# EasyEDA Pro project ProPrj_USB_hub_2026-05-25.epro

# Schematic Schematic1
Board Name: Board1; Create Date: 2026-04-25; Page Name: P1; Project Name: USB_hub; Schematic Name: Schematic1; Update Date: 2026-04-26; Company: EasyEDA.com; Page Size: A4; Version: V1.0
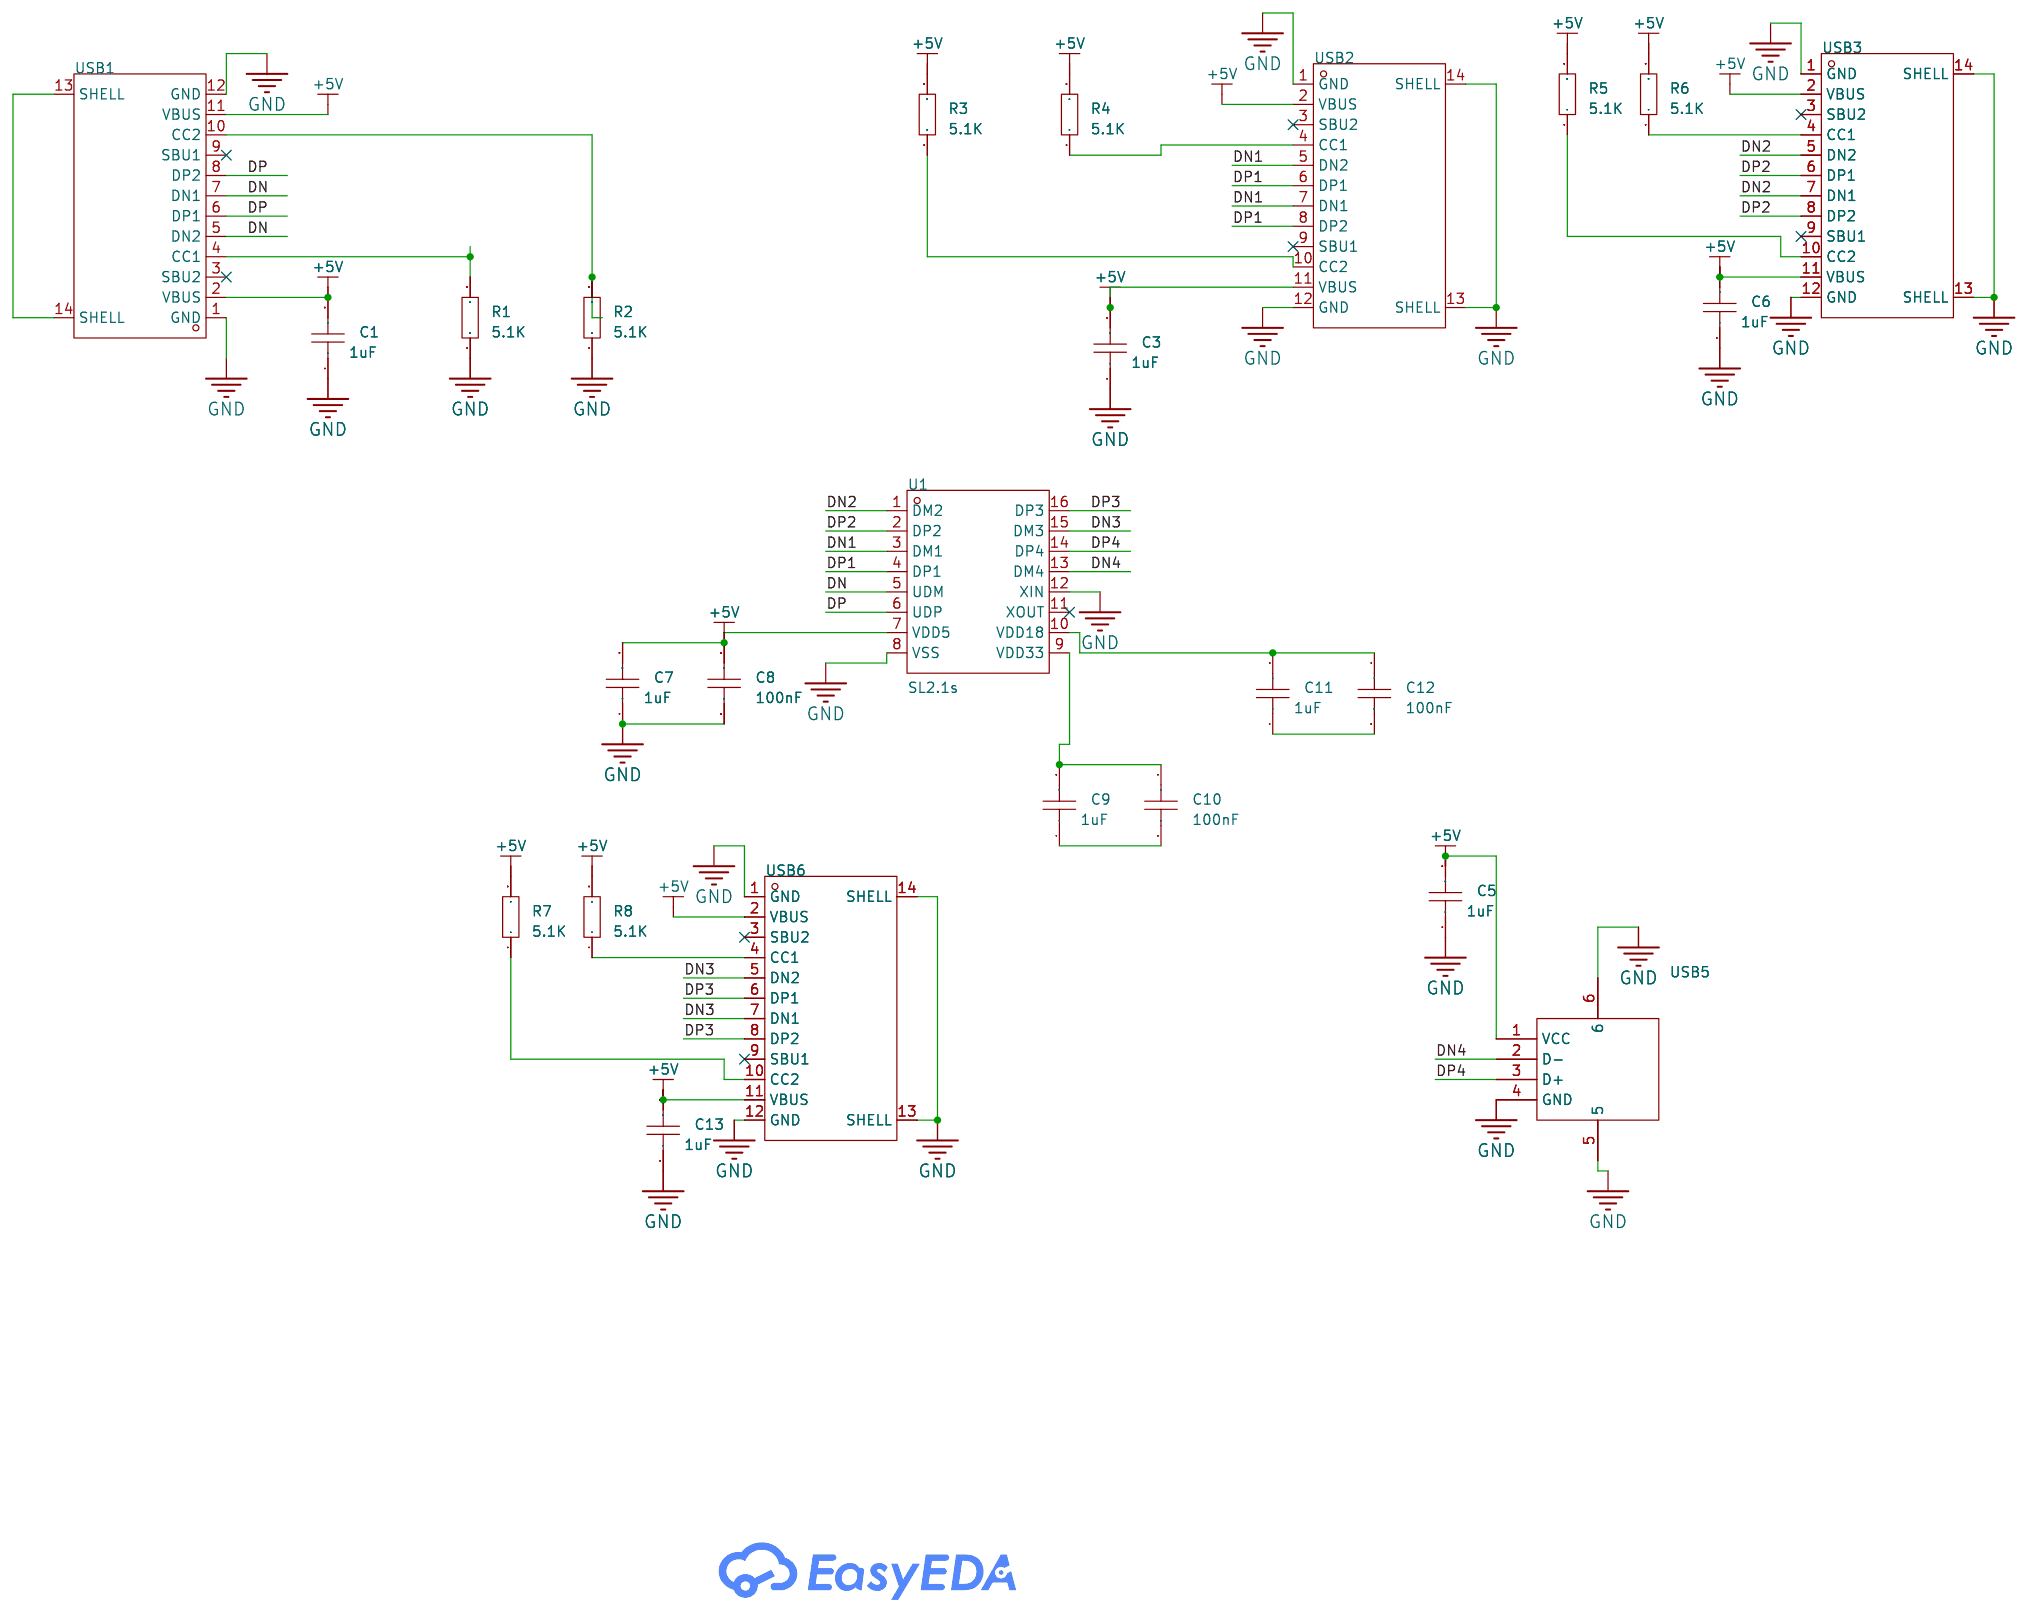
[diagram p0: schematic sheet]

## Parts
C1  1uF  [C0603]
C3  1uF  [C0603]
C5  1uF  [C0603]
C6  1uF  [C0603]
C7  1uF  [C0603]
C8  100nF  [C0603]
C9  1uF  [C0603]
C10  100nF  [C0603]
C11  1uF  [C0603]
C12  100nF  [C0603]
C13  1uF  [C0603]
R1  5.1K  [R0603]
R2  5.1K  [R0603]
R3  5.1K  [R0603]
R4  5.1K  [R0603]
R5  5.1K  [R0603]
R6  5.1K  [R0603]
R7  5.1K  [R0603]
R8  5.1K  [R0603]
U1  SL2.1s  [SSOP-16_L4.6-W2.6-P0.53-LS4.0-BL]
USB1  TYPE-C 16PIN 2MD(073)  [USB-C-SMD_TYPE-C-6PIN-2MD-073]
USB2  TYPE-C 16PIN 2MD(073)  [USB-C-SMD_TYPE-C-6PIN-2MD-073]
USB3  TYPE-C 16PIN 2MD(073)  [USB-C-SMD_TYPE-C-6PIN-2MD-073]
USB5  10.0 QHHTZB6.3  [USB-A-TH_10.0QHHTZB6.3]
USB6  TYPE-C 16PIN 2MD(073)  [USB-C-SMD_TYPE-C-6PIN-2MD-073]

## Library data of the parts
C1 C3 C5-C13 = CAP_0603: Supplier Footprint: 0603
R1-R8 = Res_0603: Supplier Footprint: 0603
U1 = SL2.1s: type:Hub USB Protocol:USB 2.0 Data Rate:- Voltage - Supply:4V~5.25V Voltage - Supply:4V~5.25V Operating Temperature:0℃~+70℃ Operating Temperature:0℃~+70℃ Memory Interface:- Current - Supply:120mA Quiescent Supply Current:2.5mA Number of Channels:4; LCSC Part Name: USB2.0 HUB控制器集成电路; Supplier Part: C2684433; Manufacturer: CoreChips(和芯润德); Supplier Footprint: SSOP-16; JLCPCB Part Class: Extended Part; Datasheet: https://item.szlcsc.com/datasheet/SL2.1s/2782346.html; Supplier: LCSC; type: Hub; USB Protocol: USB 2.0; Voltage - Supply: 4V~5.25V; Operating Temperature: 0℃~+70℃; Current - Supply: 120mA; Quiescent Supply Current: 2.5mA; Number of Channels: 4
USB1-USB3 USB6 = TYPE-C 16PIN 2MD(073): Connector Type:Type-C Protocol Standard:- Gender:Female Mounting Type:Surface Mount, Right Angle Number of Contacts:16P Number of Ports:1 Current Rating-Power:3A Voltage Rating:5V Connect-Disconnect Life:10,000 Cycles Supplementary Features:- Center Heigh; LCSC Part Name: Type-C 母 卧贴; Supplier Part: C2765186; Manufacturer: SHOU HAN(首韩); Supplier Footprint: SMD; JLCPCB Part Class: Extended Part; Datasheet: https://item.szlcsc.com/datasheet/TYPE-C%252016PIN%25202MD(073)/2901843.html; Supplier: LCSC; Connector Type: Type-C; Gender: Female; Mounting Type: Surface Mount, Right Angle; Number of Contacts: 16P; Number of Ports: 1; Current Rating-Power: 3A; Voltage Rating: 5V; Connect-Disconnect Life: 10,000 Cycles; Detection color: Black; Operating Temperature: -25℃~+85℃
USB5 = 10.0 QHHTZB6.3: Connector Type:Type-A Protocol Standard:USB 2.0 Gender:Female Mounting Type:Surface Mount, Right Angle Number of Contacts:4P Number of Ports:1 Current Rating-Power:1.5A Voltage Rating:30V Connect-Disconnect Life:5,000 times Supplementary Features:- Center; LCSC Part Name: 壳长10.0mm; Supplier Part: C668591; Manufacturer: SHOU HAN(首韩); Supplier Footprint: SMD; JLCPCB Part Class: Extended Part; Datasheet: https://item.szlcsc.com/datasheet/10.0%2520QHHTZB6.3/698534.html; Supplier: LCSC; Connector Type: Type-A; Protocol Standard: USB 2.0; Gender: Female; Mounting Type: Surface Mount, Right Angle; Number of Contacts: 4P; Number of Ports: 1; Current Rating-Power: 1.5A; Voltage Rating: 30V; Connect-Disconnect Life: 5,000 times; Length: 10mm; Detection color: Black; Operating Temperature: -25℃~+85℃

## Nets
+5V: C1.2 C3.2 C5.2 C6.2 C7.2 C8.1 C13.2 R3.2 R4.2 R5.2 R6.2 R7.2 R8.2 U1.7(VDD5) USB1.2(VBUS) USB1.11(VBUS) USB2.2(VBUS) USB2.11(VBUS) USB3.2(VBUS) USB3.11(VBUS) USB5.1(VCC) USB6.2(VBUS) USB6.11(VBUS)
GND: C1.1 C3.1 C5.1 C6.1 C7.1 C8.2 C13.1 R1.1 R2.1 U1.8(VSS) U1.12(XIN) USB1.1(GND) USB1.12(GND) USB2.1(GND) USB2.12(GND) USB2.13(SHELL) USB2.14(SHELL) USB3.1(GND) USB3.12(GND) USB3.13(SHELL) USB3.14(SHELL) USB5.4(GND) USB5.5 USB5.6 USB6.1(GND) USB6.12(GND) USB6.13(SHELL) USB6.14(SHELL)
DN: U1.5(UDM) USB1.5(DN2) USB1.7(DN1)
DN1: U1.3(DM1) USB2.5(DN2) USB2.7(DN1)
DN2: U1.1(DM2) USB3.5(DN2) USB3.7(DN1)
DN3: U1.15(DM3) USB6.5(DN2) USB6.7(DN1)
DN4: U1.13(DM4) USB5.2(D-)
DP: U1.6(UDP) USB1.6(DP1) USB1.8(DP2)
DP1: U1.4(DP1) USB2.6(DP1) USB2.8(DP2)
DP2: U1.2(DP2) USB3.6(DP1) USB3.8(DP2)
DP3: U1.16(DP3) USB6.6(DP1) USB6.8(DP2)
DP4: U1.14(DP4) USB5.3(D+)
$1N1031: USB1.13(SHELL) USB1.14(SHELL)
$1N1114: R1.2 USB1.4(CC1)
$1N1121: R2.2 USB1.10(CC2)
$1N1950: R4.1 USB2.4(CC1)
$1N2056: R6.1 USB3.4(CC1)
$1N2060: R5.1 USB3.10(CC2)
$1N2827: R3.1 USB2.10(CC2)
$1N3280: C9.2 C10.1 U1.9(VDD33)
$1N3283: C9.1 C10.2
$1N3346: C11.2 C12.1 U1.10(VDD18)
$1N3348: C11.1 C12.2
$1N4259: R8.1 USB6.4(CC1)
$1N4260: R7.1 USB6.10(CC2)

Not connected (* = marked no-connect by the designer): U1 11(XOUT)*; USB1 3(SBU2)* 9(SBU1)*; USB2 3(SBU2)* 9(SBU1)*; USB3 3(SBU2)* 9(SBU1)*; USB6 3(SBU2)* 9(SBU1)*

# Board PCB1
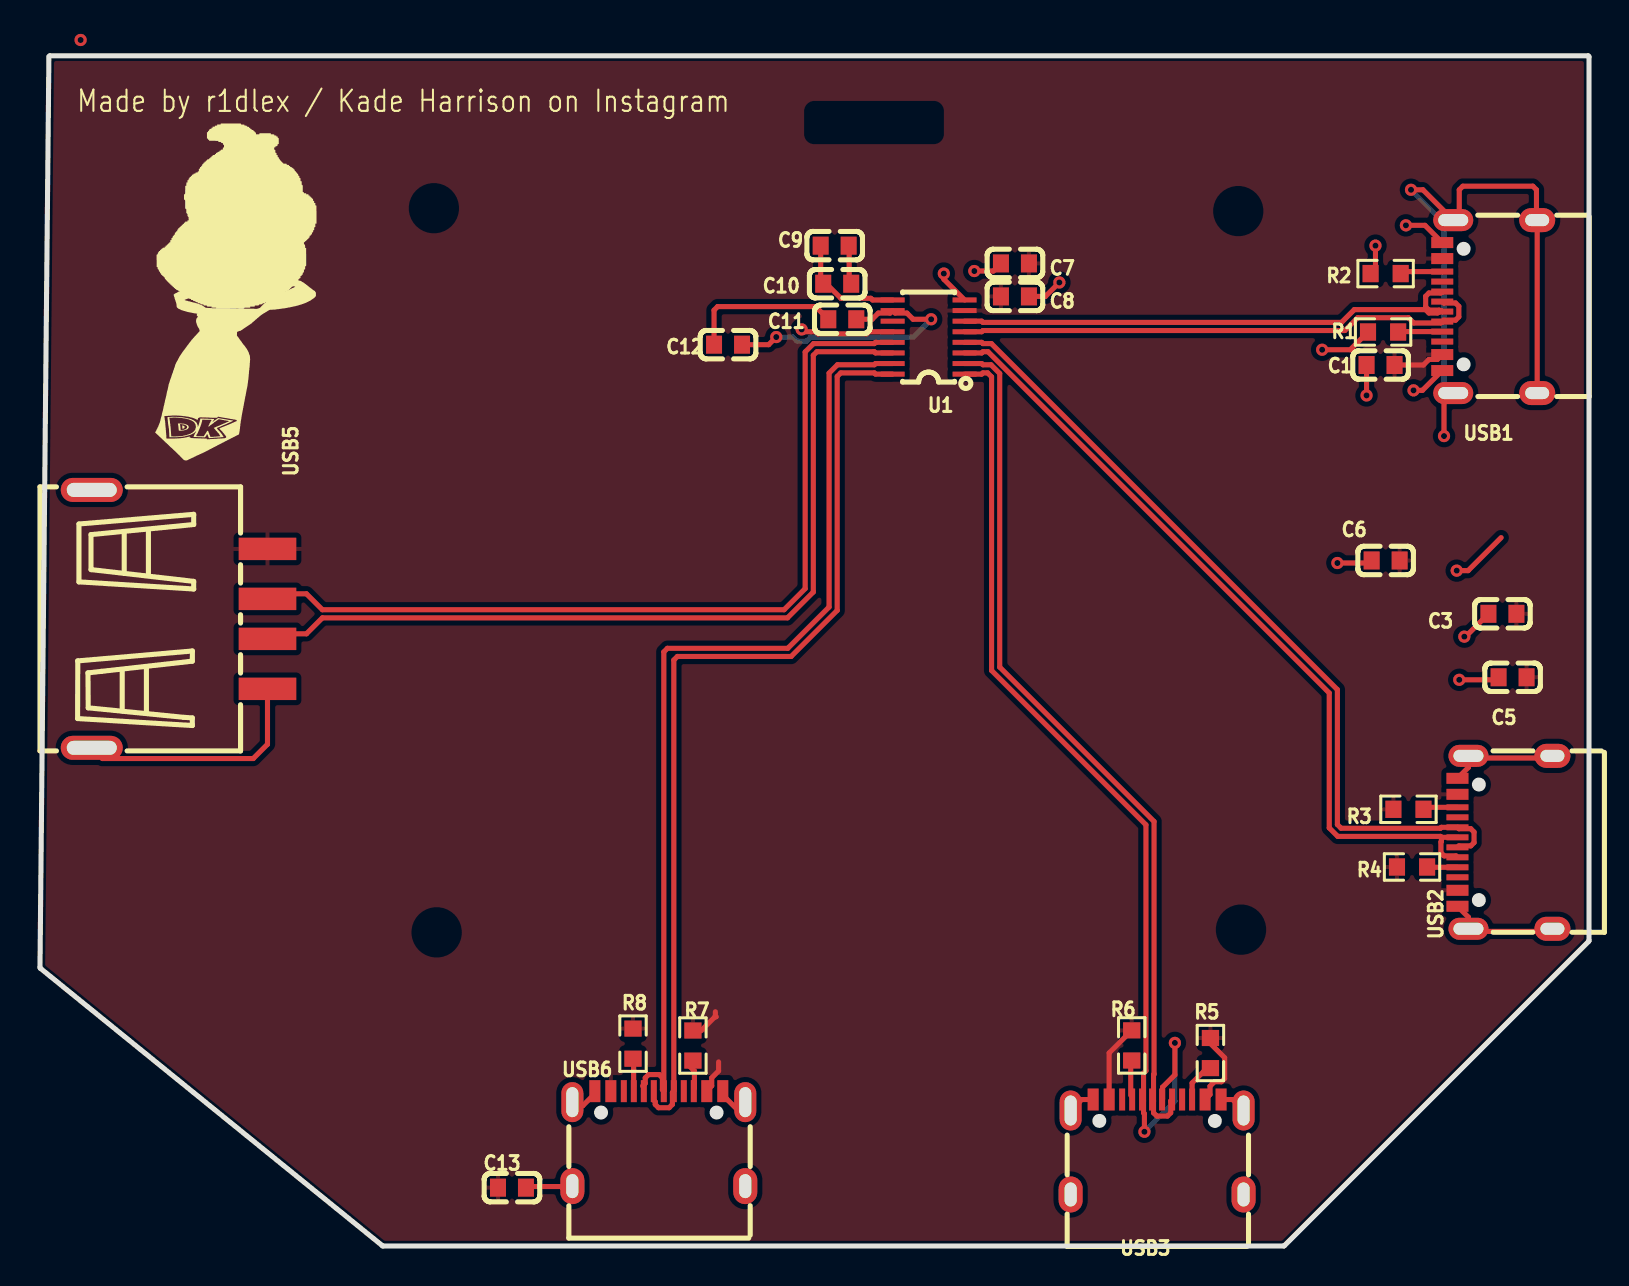
[diagram p1: board, top side]
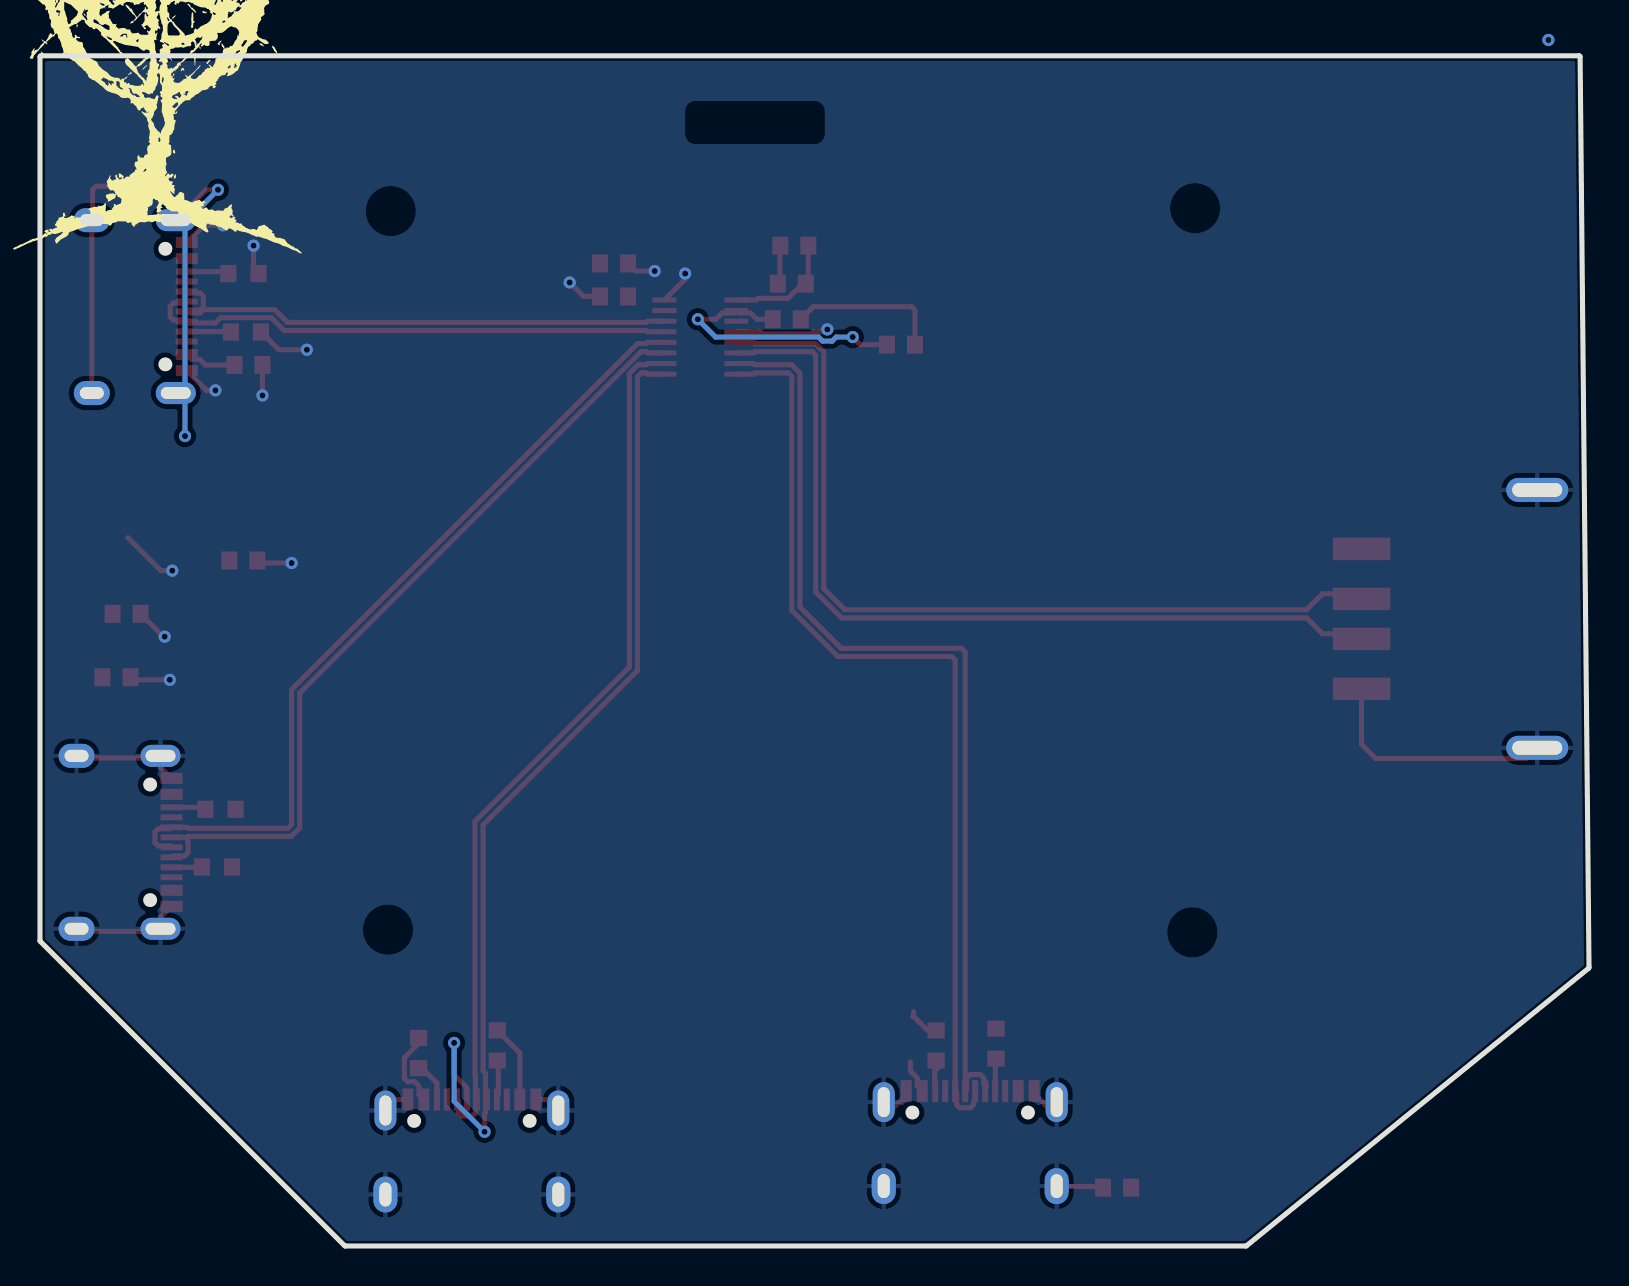
[diagram p2: board, bottom side, seen from below]

Outline 77.48 x 59.53 mm; copper layers: Top Layer, Bottom Layer. Coordinates in mm from the lower left corner of the outline.
Outline path: 0.02,13.89 arc(0.01,13.91) 0,13.93 0.45,59.48 arc(0.46,59.52) 0.5,59.53 77.43,59.53 arc(77.47,59.52) 77.48,59.48 77.48,15.27 arc(77.48,15.26) 77.47,15.24 62.24,0.01 arc(62.23,0) 62.21,0 17.16,0 arc(17.15,0) 17.13,0.01 0.02,13.89
Stack: Top Layer 0.035mm / Dielectric1 1.51mm FR4 er 4.5 / Bottom Layer 0.035mm

## Design rules (mm)
net DN2: DP3
net DP2: DP3
net DN1: DP2
net DP1: DP2
net DN: DP1
net DP: DP1
net DN4: DP5
net DP4: DP5
net DN3: DP4
net DP3: DP4
template: Custom Config
spacing copperThickness1oz (default): track to track 0.102, other pairs 0.152 to 0.3
spacing copperThickness2oz: track to track 0.203, other pairs 0.152 to 0.3
track width copperThickness1oz (default): min 0.127, default 0.254, max 2.54
track width copperThickness2oz: min 0.203, default 0.254, max 2.54
differential pair differentialPair (default): width min 0.127, default 0.254, max 2.54; gap min 0.152, default 0.152
via viaSize (default): diameter min 0.5, default 0.61, max 10; hole min 0.3, default 0.305, max 6.3

## Placement (name value [footprint] x y rotation side)
C1  1uF  [C0603]  67.06 44.07 0 top
C3  1uF  [C0603]  73.15 31.62 0 top
C5  1uF  [C0603]  73.66 28.45 0 top
C6  1uF  [C0603]  67.31 34.29 0 top
C7  1uF  [C0603]  48.77 49.15 0 top
C8  100nF  [C0603]  48.77 47.5 0 top
C9  1uF  [C0603]  39.75 50.04 180 top
C10  100nF  [C0603]  39.88 48.13 0 top
C11  1uF  [C0603]  40.13 46.35 0 top
C12  100nF  [C0603]  34.42 45.08 180 top
C13  1uF  [C0603]  23.61 2.92 180 top
R1  5.1K  [R0603]  67.18 45.72 0 top
R2  5.1K  [R0603]  67.31 48.64 0 top
R3  5.1K  [R0603]  68.45 21.84 180 top
R4  5.1K  [R0603]  68.63 18.96 180 top
R5  5.1K  [R0603]  58.55 9.65 90 top
R6  5.1K  [R0603]  54.61 10.03 90 top
R7  5.1K  [R0603]  32.66 10.03 90 top
R8  5.1K  [R0603]  29.66 10.12 90 top
U1  SL2.1s  [SSOP-16_L4.6-W2.6-P0.53-LS4.0-BL]  44.45 45.47 90 top
USB1  TYPE-C 16PIN 2MD(073)  [USB-C-SMD_TYPE-C-6PIN-2MD-073]  72.52 46.99 90 top
USB2  TYPE-C 16PIN 2MD(073)  [USB-C-SMD_TYPE-C-6PIN-2MD-073]  73.28 20.19 90 top
USB3  TYPE-C 16PIN 2MD(073)  [USB-C-SMD_TYPE-C-6PIN-2MD-073]  55.88 4.95 0 top
USB5  10.0 QHHTZB6.3  [USB-A-TH_10.0QHHTZB6.3]  6.98 31.37 270 top
USB6  TYPE-C 16PIN 2MD(073)  [USB-C-SMD_TYPE-C-6PIN-2MD-073]  30.95 5.37 0 top

## Footprints (pads in the part's own frame, mm; a bottom-side part is the same pattern mirrored in y, then rotated)
C0603
  rect 0.8x0.9 smd: 1(-0.7,0) 2(0.7,0)
R0603
  rect 0.806x0.864 smd: 1(-0.753,0) 2(0.753,0)
SSOP-16_L4.6-W2.6-P0.53-LS4.0-BL
  rect 0.25x1.2 smd: 1(-1.855,-1.8) 2(-1.325,-1.8) 3(-0.795,-1.8) 4(-0.265,-1.8) 5(0.265,-1.8) 6(0.795,-1.8) 7(1.325,-1.8) 8(1.855,-1.8) 9(1.855,1.8) 10(1.325,1.8) 11(0.795,1.8) 12(0.265,1.8) 13(-0.265,1.8) 14(-0.795,1.8) 15(-1.325,1.8) 16(-1.855,1.8)
USB-A-TH_10.0QHHTZB6.3
  rect 1.12x2.88 smd: 1(-3.5,4.395) 2(-1,4.395) 3(1,4.395) 4(3.5,4.395)
  oval 1.2x3.1 hole 0.7x2.5: 5(-6.45,-4.395) 6(6.45,-4.395)
USB-C-SMD_TYPE-C-6PIN-2MD-073
  rect 0.55x1.1 smd: 1(-3.2,2.375) 2(-2.4,2.375) 11(2.4,2.375) 12(3.2,2.375)
  rect 0.3x1.1 smd: 3(-1.75,2.375) 4(-1.25,2.375) 5(-0.75,2.375) 6(-0.25,2.375) 7(0.25,2.375) 8(0.75,2.375) 9(1.25,2.375) 10(1.75,2.375)
  oval 1.1x2 hole 0.6x1.5: 13(-4.325,1.825) 14(4.325,1.825)
  oval 1.2x1.8 hole 0.6x1.2: 13(-4.325,-2.375) 14(4.325,-2.375)

## Nets
As in the schematic.

Pads without a net: U1 11; USB1 3 9; USB2 3 9; USB3 3 9; USB6 3 9

## Via types
v1: diameter 0.61, hole 0.305, Top Layer to Bottom Layer, 20 vias

## Routing (per net, layer and track width the routed paths; a pad name or vN(x,y) marks a point on that pad's centre or on a via; arc(x,y) is an arc through that point)
+5V: length 13.4
  Top Layer w0.254: 33.95,9.21 33.95,8.76 33.6,8.41 33.6,8.01 33.4,7.81 ; USB3.2 53.48,9.66 R6.2 ; USB1.2 69.9,44.34 69.48,44.34 69.2,44.07 C1.2 ; R5.2 58.55,10.13 59.26,9.42 59.26,8.38 59.09,8.22 58.75,8.22 58.53,7.99 58.53,7.57 USB3.11 ; 33.06,10.76 33.77,11.47 33.82,11.47 33.78,11.5 33.78,11.72
GND: length 55
  Top Layer w0.254: 73.09,35.43 71.44,33.78 v1(70.87,33.78) ; 24.44,2.97 26.06,2.97 26.2,2.84 ; USB2.1 71.45,16.44 USB2.13 ; USB5.6 3.12,24.38 10.67,24.38 11.38,25.1 USB5.4 ; v1(50.99,48.2) 50.29,47.5 C8.2 ; USB3.14 59.65,7.33 USB3.12 ; USB2.12 71.45,23.94 USB2.14 ; v1(64.9,34.16) 66.48,34.16 C6.1 ; v1(66.8,50.04) 66.8,48.89 R2.1 ; 27.04,7.02 27.15,7.02 27.66,7.53 ; v1(71.25,30.48) 71.31,30.48 C3.1 ; v1(38.1,45.85) 38.22,45.73 38.81,45.73 38.92,45.63 41.35,45.63 41.45,45.73 U1.12 ; 35.15,6.55 34.31,7.4 34.15,7.4 ; v1(68.71,42.8) 69.15,42.8 USB1.1 ; C5.1 72.83,28.32 v1(70.99,28.32) ; C1.1 v1(66.36,42.55) ; USB3.1 52.11,7.33 USB3.13 ; 72.27,24.41 74.84,24.41 75.03,24.22 ; R1.1 65.54,44.83 v1(64.14,44.83) ; 75.19,15.55 75,15.74 72.38,15.74 ; v1(68.33,51.05) 69.28,51.05 USB1.12 ; v1(45.21,48.64) 45.21,48.36 U1.8 ; C7.1 47.69,48.77 v1(46.74,48.77)
(no net):
  vias: v1(2.03,60.32)
DN: length 26.7
  Top Layer w0.254: U1.5 47.1,45.73 47.17,45.79 65.27,45.79 65.91,46.43 68.45,46.43 68.72,46.17 70.07,46.17 USB1.5 70.21,46.31 70.81,46.31 70.97,46.47 70.97,47.01 70.81,47.17 70.21,47.17 USB1.7
DN1: length 40.4
  Top Layer w0.254: USB2.5 70.83,19.51 70.24,19.51 70.08,19.68 70.08,20.21 70.1,20.23 70.1,20.44 ; 70.1,20.44 70.05,20.49 64.91,20.49 64.49,20.91 64.49,27.66 47.42,44.73 47.17,44.73 47.1,44.67 U1.3 ; 70.1,20.44 USB2.7
DN2: length 50.8
  Top Layer w0.254: 55.2,7.26 55.2,8.64 55.32,8.76 55.32,21.07 47.6,28.79 47.6,43.47 47.4,43.67 47.17,43.67 47.1,43.61 U1.1 ; 55.2,7.26 55.2,6.66 55.24,6.62 v1(55.24,5.72) ; 55.2,7.26 USB3.5 ; v1(56.77,10.16) 56.77,8.56 56.15,7.95 56.15,7.35 USB3.7
  Bottom Layer w0.254: v1(55.24,5.72) 56.77,7.24 v1(56.77,10.16)
DN3: length 48.4
  Top Layer w0.254: U1.15 41.8,44.14 41.73,44.08 39.89,44.08 39.47,43.66 39.47,31.96 37.41,29.9 31.38,29.9 31.2,29.72 USB6.7 31.13,7.82 31.13,8.41 30.97,8.58 30.44,8.58 30.28,8.41 30.28,8.13 30.15,8
DN4: length 43.8
  Top Layer w0.254: 11.63,32.62 13.33,32.62 14.12,31.83 37.22,31.83 38.28,32.88 38.28,44.72 38.69,45.14 41.73,45.14 41.8,45.2 U1.13
DP: length 26.7
  Top Layer w0.254: USB1.8 70.07,47.67 69.48,47.67 69.31,47.51 69.31,46.97 69.48,46.81 70,46.81 70.05,46.76 70.12,46.76 USB1.6 69.97,46.74 69.9,46.67 69.48,46.67 69.31,46.84 65.74,46.84 65.1,46.2 47.17,46.2 47.1,46.26 U1.6
DP1: length 41.1
  Top Layer w0.254: U1.4 47.1,45.2 47.17,45.14 47.59,45.14 64.9,27.83 64.9,21.08 65.08,20.9 70.05,20.9 70.1,20.94 USB2.8 70.97,20.87 71.57,20.87 71.73,20.71 71.73,20.18 71.57,20.01 70.97,20.01 USB2.6
DP2: length 43.9
  Top Layer w0.254: 55.7,7.26 USB3.6 ; 55.7,7.26 55.7,6.66 55.86,6.5 56.4,6.5 56.56,6.66 56.56,7.26 USB3.8 ; 55.7,7.26 55.7,8.57 55.73,8.59 55.73,21.23 48.01,28.96 48.01,43.64 47.57,44.08 47.17,44.08 47.1,44.14 U1.2
DP3: length 47.2
  Top Layer w0.254: U1.16 41.8,43.61 41.73,43.67 40.06,43.67 39.88,43.49 39.88,31.79 37.57,29.49 31.88,29.49 31.7,29.31 USB6.8 31.63,7.68 31.63,7.08 31.47,6.92 30.94,6.92 30.78,7.08 30.78,7.22 30.72,7.27
DP4: length 43.8
  Top Layer w0.254: U1.14 41.8,44.67 41.73,44.73 38.86,44.73 38.68,44.55 38.68,32.71 37.39,31.42 14.12,31.42 13.33,30.62 11.63,30.62
$1N1031: length 33.9
  Top Layer w0.254: USB1.13 USB1.14 74.86,51.35 74.86,52.83 74.68,53.01 71.17,53.01 70.99,52.83 70.99,51.62 USB1.14 69.17,52.83 v1(68.58,52.83) ; USB1.13 70.23,42.2 v1(70.23,40.51)
  Bottom Layer w0.254: v1(68.58,52.83) 70.23,51.18 v1(70.23,40.51)
$1N1114: length 2.2
  Top Layer w0.254: R1.2 67.96,45.74 USB1.4
$1N1121: length 2.1
  Top Layer w0.254: USB1.10 68.16,48.74 R2.2
$1N1950: length 1.5
  Top Layer w0.254: USB2.4 69.4,18.94 R4.1
$1N2056: length 1.4
  Top Layer w0.254: 54.56,7.54 54.56,8.97
$1N2060: length 2.1
  Top Layer w0.254: USB3.10 57.63,8.16 58.37,8.9 R5.1
$1N2827: length 1.7
  Top Layer w0.254: R3.1 69.31,21.94 USB2.10
$1N3280: length 5.8
  Top Layer w0.254: U1.9 41.64,47.32 41.56,47.4 40.06,47.4 39.33,48.13 C10.1 39.05,48.26 C9.2
$1N3283: length 1.9
  Top Layer w0.254: 40.45,50.04 40.48,50.01 40.48,48.13
$1N3346: length 14.3
  Top Layer w0.254: v1(36.83,45.47) 36.45,45.08 C12.1 ; C11.2 41.62,46.35 41.93,46.66 42.52,46.66 U1.10 42.78,46.66 43.37,46.66 43.68,46.35 v1(44.58,46.35)
  Bottom Layer w0.254: v1(44.58,46.35) 43.69,45.47 38.55,45.47 38.34,45.26 37.86,45.26 37.65,45.47 v1(36.83,45.47)
$1N3348: length 7.8
  Top Layer w0.254: C12.2 33.72,46.81 33.9,46.99 38.8,46.99 C11.1
$1N4259: length 1.4
  Top Layer w0.254: 29.66,9.35 29.7,9.31 29.7,7.96
$1N4260: length 1.3
  Top Layer w0.254: 32.43,9.06 32.73,8.75 32.73,7.87

## Copper pours and planes (outline as drawn; the poured copper is in the pictures)
+5V on Top Layer: -5.72,67.82 80.64,67.82 80.64,-12.32 -5.72,-12.32
GND on Bottom Layer: -1.71,-16.66 -1.71,75.8 72.46,75.8 72.46,-16.66
GND on Bottom Layer: -5.87,64.78 82.49,64.78 82.49,-3.19 -5.87,-3.19

## Text on the board
Top Silkscreen Layer: Made by r1dlex / Kade Harrison on Instagram
